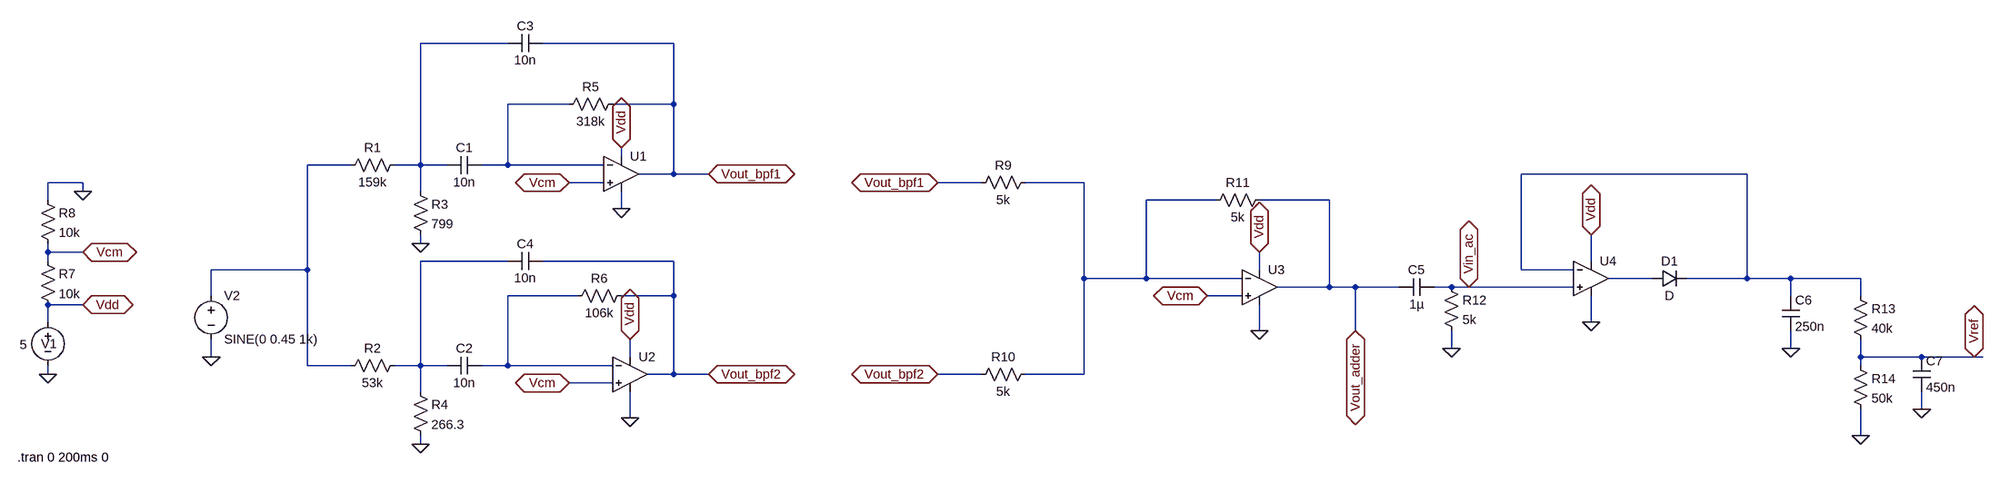
[diagram p0: schematic EE18B027_exp7 (2).asc]
EE18B027_exp7 (2).asc, the LTspice schematic file:
Version 4
SHEET 1 2532 680
WIRE -544 -496 -704 -496
WIRE -240 -496 -480 -496
WIRE -432 -384 -544 -384
WIRE -240 -384 -240 -496
WIRE -240 -384 -352 -384
WIRE -336 -288 -336 -304
WIRE -832 -272 -912 -272
WIRE -704 -272 -704 -496
WIRE -704 -272 -752 -272
WIRE -656 -272 -704 -272
WIRE -544 -272 -544 -384
WIRE -544 -272 -592 -272
WIRE -368 -272 -544 -272
WIRE -240 -256 -240 -384
WIRE -240 -256 -304 -256
WIRE -176 -256 -240 -256
WIRE 2032 -256 1616 -256
WIRE -1520 -240 -1584 -240
WIRE -368 -240 -432 -240
WIRE 576 -240 496 -240
WIRE 784 -240 656 -240
WIRE -1520 -224 -1520 -240
WIRE -704 -224 -704 -272
WIRE -1584 -208 -1584 -240
WIRE 1056 -208 928 -208
WIRE 1264 -208 1136 -208
WIRE -336 -192 -336 -224
WIRE -704 -128 -704 -144
WIRE -1584 -112 -1584 -128
WIRE -1520 -112 -1584 -112
WIRE -1584 -96 -1584 -112
WIRE -544 -96 -704 -96
WIRE -240 -96 -480 -96
WIRE 1744 -96 1744 -144
WIRE -912 -80 -912 -272
WIRE -912 -80 -1088 -80
WIRE 1136 -80 1136 -112
WIRE 1616 -80 1616 -256
WIRE 1712 -80 1616 -80
WIRE 784 -64 784 -240
WIRE 928 -64 928 -208
WIRE 928 -64 784 -64
WIRE 1104 -64 928 -64
WIRE 1856 -64 1776 -64
WIRE 2032 -64 2032 -256
WIRE 2032 -64 1920 -64
WIRE 2112 -64 2032 -64
WIRE 2240 -64 2112 -64
WIRE 1264 -48 1264 -208
WIRE 1264 -48 1168 -48
WIRE 1312 -48 1264 -48
WIRE 1392 -48 1312 -48
WIRE 1488 -48 1456 -48
WIRE 1520 -48 1488 -48
WIRE 1712 -48 1520 -48
WIRE -1088 -32 -1088 -80
WIRE -416 -32 -544 -32
WIRE -240 -32 -240 -96
WIRE -240 -32 -336 -32
WIRE 1104 -32 1040 -32
WIRE 2112 -32 2112 -64
WIRE 2240 -32 2240 -64
WIRE -1520 -16 -1584 -16
WIRE -1584 16 -1584 -16
WIRE 1744 16 1744 -32
WIRE 1136 32 1136 -16
WIRE 1312 32 1312 -48
WIRE 1488 64 1488 32
WIRE 2112 64 2112 32
WIRE -1088 80 -1088 48
WIRE -320 80 -320 48
WIRE 2240 80 2240 48
WIRE 2352 80 2240 80
WIRE 2448 80 2352 80
WIRE 2464 80 2448 80
WIRE -912 96 -912 -80
WIRE -832 96 -912 96
WIRE -704 96 -704 -96
WIRE -704 96 -752 96
WIRE -656 96 -704 96
WIRE -544 96 -544 -32
WIRE -544 96 -592 96
WIRE -352 96 -544 96
WIRE 2240 96 2240 80
WIRE -1584 112 -1584 96
WIRE -240 112 -240 -32
WIRE -240 112 -288 112
WIRE -176 112 -240 112
WIRE 576 112 496 112
WIRE 784 112 784 -64
WIRE 784 112 656 112
WIRE -352 128 -432 128
WIRE -704 144 -704 96
WIRE 2352 176 2352 144
WIRE -320 192 -320 144
WIRE 2240 224 2240 176
WIRE -704 240 -704 224
FLAG -704 -128 0
FLAG -704 240 0
FLAG -1088 80 0
FLAG -1584 112 0
FLAG -1520 -224 0
FLAG -1520 -16 Vdd
IOPIN -1520 -16 BiDir
FLAG -1520 -112 Vcm
IOPIN -1520 -112 BiDir
FLAG -432 -240 Vcm
IOPIN -432 -240 BiDir
FLAG -432 128 Vcm
IOPIN -432 128 BiDir
FLAG -320 192 0
FLAG -336 -192 0
FLAG -336 -304 Vdd
IOPIN -336 -304 BiDir
FLAG -320 48 Vdd
IOPIN -320 48 BiDir
FLAG -176 -256 Vout_bpf1
IOPIN -176 -256 BiDir
FLAG -176 112 Vout_bpf2
IOPIN -176 112 BiDir
FLAG 1136 32 0
FLAG 1136 -112 Vdd
IOPIN 1136 -112 BiDir
FLAG 1040 -32 Vcm
IOPIN 1040 -32 BiDir
FLAG 1312 32 Vout_adder
IOPIN 1312 32 BiDir
FLAG 496 -240 Vout_bpf1
IOPIN 496 -240 BiDir
FLAG 496 112 Vout_bpf2
IOPIN 496 112 BiDir
FLAG 1488 64 0
FLAG 1520 -48 Vin_ac
IOPIN 1520 -48 BiDir
FLAG 1744 16 0
FLAG 1744 -144 Vdd
IOPIN 1744 -144 BiDir
FLAG 2112 64 0
FLAG 2240 224 0
FLAG 2352 176 0
FLAG 2448 80 Vref
IOPIN 2448 80 BiDir
SYMBOL res -736 -288 R90
WINDOW 0 0 56 VBottom 2
WINDOW 3 32 56 VTop 2
SYMATTR InstName R1
SYMATTR Value 159k
SYMBOL res -736 80 R90
WINDOW 0 0 56 VBottom 2
WINDOW 3 32 56 VTop 2
SYMATTR InstName R2
SYMATTR Value 53k
SYMBOL cap -592 -288 R90
WINDOW 0 0 32 VBottom 2
WINDOW 3 32 32 VTop 2
SYMATTR InstName C1
SYMATTR Value 10n
SYMBOL res -720 -240 R0
SYMATTR InstName R3
SYMATTR Value 799
SYMBOL res -720 128 R0
SYMATTR InstName R4
SYMATTR Value 266.3
SYMBOL cap -592 80 R90
WINDOW 0 0 32 VBottom 2
WINDOW 3 32 32 VTop 2
SYMATTR InstName C2
SYMATTR Value 10n
SYMBOL Opamps\\UniversalOpamp2 -336 -256 R0
SYMATTR InstName U1
SYMBOL Opamps\\UniversalOpamp2 -320 112 R0
SYMATTR InstName U2
SYMBOL res -336 -400 R90
WINDOW 0 0 56 VBottom 2
WINDOW 3 32 56 VTop 2
SYMATTR InstName R5
SYMATTR Value 318k
SYMBOL res -320 -48 R90
WINDOW 0 0 56 VBottom 2
WINDOW 3 32 56 VTop 2
SYMATTR InstName R6
SYMATTR Value 106k
SYMBOL cap -480 -512 R90
WINDOW 0 0 32 VBottom 2
WINDOW 3 32 32 VTop 2
SYMATTR InstName C3
SYMATTR Value 10n
SYMBOL cap -480 -112 R90
WINDOW 0 0 32 VBottom 2
WINDOW 3 32 32 VTop 2
SYMATTR InstName C4
SYMATTR Value 10n
SYMBOL voltage -1584 0 R0
WINDOW 0 -13 56 Left 2
WINDOW 3 -52 58 Left 2
WINDOW 123 0 0 Left 0
WINDOW 39 0 0 Left 0
SYMATTR InstName V1
SYMATTR Value 5
SYMBOL res -1600 -112 R0
SYMATTR InstName R7
SYMATTR Value 10k
SYMBOL res -1600 -224 R0
SYMATTR InstName R8
SYMATTR Value 10k
SYMBOL voltage -1088 -48 R0
WINDOW 123 0 0 Left 0
WINDOW 39 0 0 Left 0
SYMATTR InstName V2
SYMATTR Value SINE(0 0.45 1k)
SYMBOL res 672 -256 R90
WINDOW 0 0 56 VBottom 2
WINDOW 3 32 56 VTop 2
SYMATTR InstName R9
SYMATTR Value 5k
SYMBOL res 672 96 R90
WINDOW 0 0 56 VBottom 2
WINDOW 3 32 56 VTop 2
SYMATTR InstName R10
SYMATTR Value 5k
SYMBOL Opamps\\UniversalOpamp2 1136 -48 R0
SYMATTR InstName U3
SYMBOL res 1152 -224 R90
WINDOW 0 0 56 VBottom 2
WINDOW 3 32 56 VTop 2
SYMATTR InstName R11
SYMATTR Value 5k
SYMBOL cap 1456 -64 R90
WINDOW 0 0 32 VBottom 2
WINDOW 3 32 32 VTop 2
SYMATTR InstName C5
SYMATTR Value 1µ
SYMBOL res 1472 -64 R0
SYMATTR InstName R12
SYMATTR Value 5k
SYMBOL Opamps\\UniversalOpamp2 1744 -64 R0
SYMATTR InstName U4
SYMBOL cap 2096 -32 R0
SYMATTR InstName C6
SYMATTR Value 250n
SYMBOL res 2224 -48 R0
SYMATTR InstName R13
SYMATTR Value 40k
SYMBOL res 2224 80 R0
SYMATTR InstName R14
SYMATTR Value 50k
SYMBOL cap 2336 80 R0
SYMATTR InstName C7
SYMATTR Value 450n
SYMBOL diode 1856 -48 R270
WINDOW 0 32 32 VTop 2
WINDOW 3 0 32 VBottom 2
SYMATTR InstName D1
TEXT -1640 264 Left 2 !.tran 0 200ms 0

The netlist it stands for:
* EE18B027_exp7 (2).asc
R1 N001 N003 159k
R2 N006 N003 53k
C1 N002 N001 10n
R3 N001 0 799
R4 N006 0 266.3
C2 N008 N006 10n
XU1 Vcm N002 Vdd 0 Vout_bpf1 level.2 Avol=1Meg GBW=10Meg Slew=10Meg ilimit=25m rail=0 Vos=0 phimargin=45 en=0 enk=0 in=0 ink=0 Rin=500Meg  ; pins IN+ IN- V+ V- OUT
XU2 Vcm N008 Vdd 0 Vout_bpf2 level.2 Avol=1Meg GBW=10Meg Slew=10Meg ilimit=25m rail=0 Vos=0 phimargin=45 en=0 enk=0 in=0 ink=0 Rin=500Meg  ; pins IN+ IN- V+ V- OUT
R5 Vout_bpf1 N002 318k
R6 Vout_bpf2 N008 106k
C3 Vout_bpf1 N001 10n
C4 Vout_bpf2 N006 10n
V1 Vdd 0 5
R7 Vcm Vdd 10k
R8 0 Vcm 10k
V2 N003 0 SINE(0 0.45 1k)
R9 N005 Vout_bpf1 5k
R10 N005 Vout_bpf2 5k
XU3 Vcm N005 Vdd 0 Vout_adder level.2 Avol=1Meg GBW=10Meg Slew=10Meg ilimit=25m rail=0 Vos=0 phimargin=45 en=0 enk=0 in=0 ink=0 Rin=500Meg  ; pins IN+ IN- V+ V- OUT
R11 Vout_adder N005 5k
C5 Vin_ac Vout_adder 1µ
R12 Vin_ac 0 5k
XU4 Vin_ac N004 Vdd 0 N007 level.2 Avol=1Meg GBW=10Meg Slew=10Meg ilimit=25m rail=0 Vos=0 phimargin=45 en=0 enk=0 in=0 ink=0 Rin=500Meg  ; pins IN+ IN- V+ V- OUT
C6 N004 0 250n
R13 N004 Vref 40k
R14 Vref 0 50k
C7 Vref 0 450n
D1 N007 N004 D
.model D D
.lib standard.dio
.tran 0 200ms 0
.lib UniversalOpamps2.sub
.backanno
.end